# Altium schematic sheet Quad-RS232-1.0-RS232.SchDoc: Quad UART - RS232
size A4; Revision: 1.0; SheetNumber: 3; SheetTotal: 4
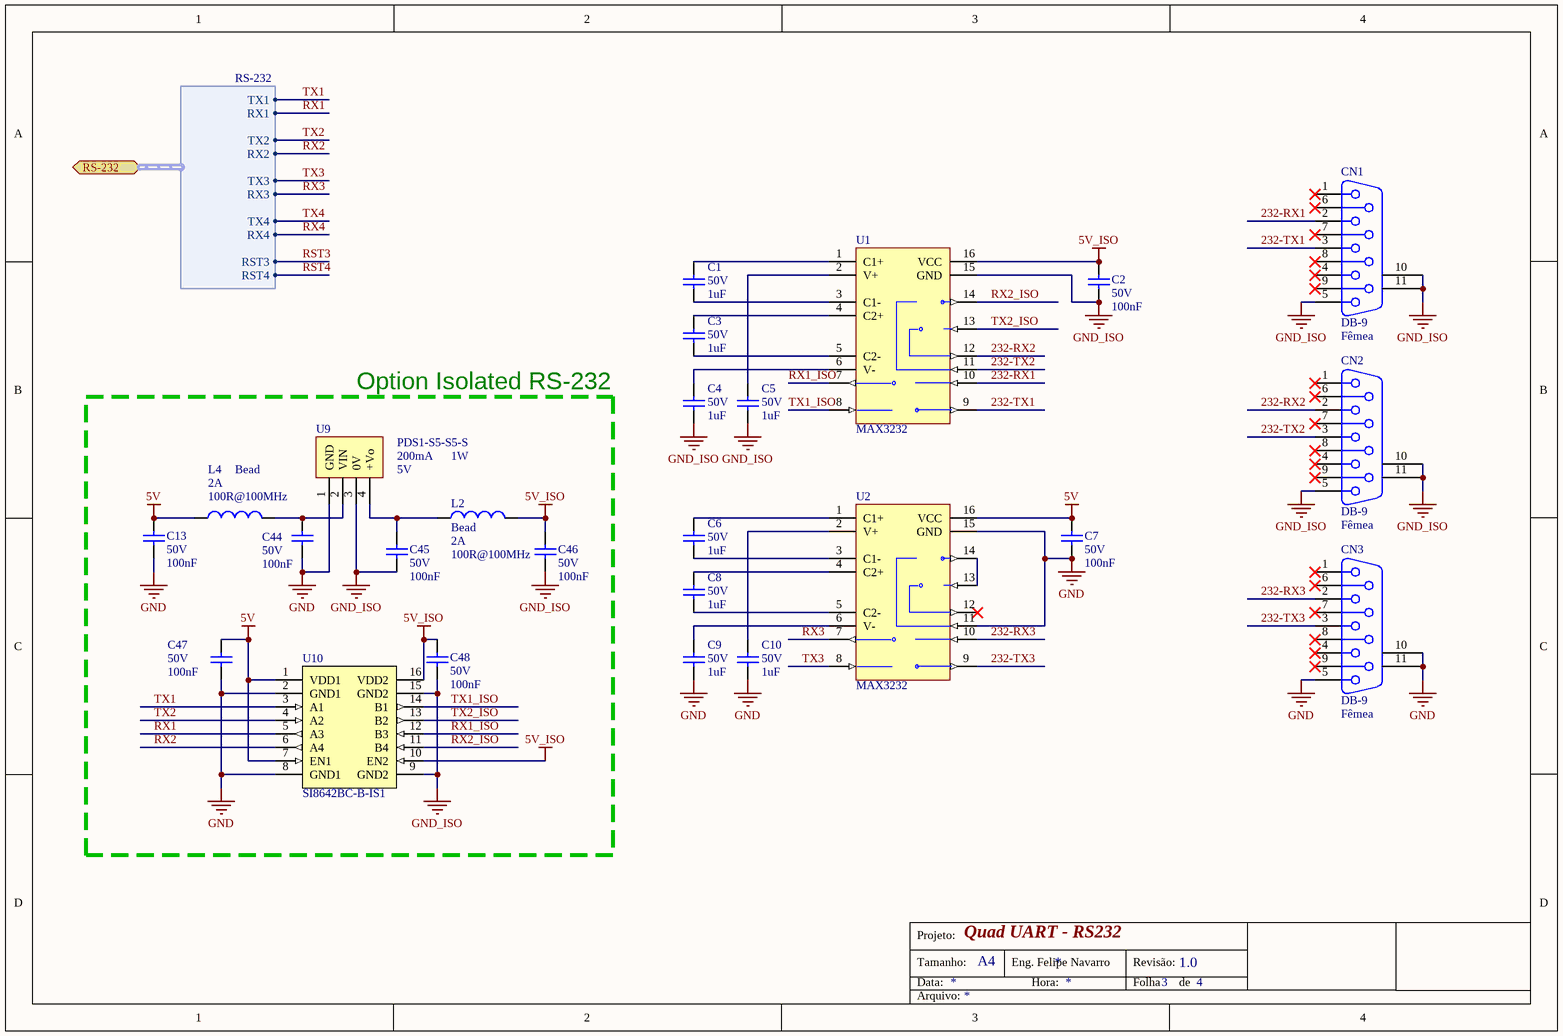
[diagram p0: Quad-RS232-1.0-RS232.SchDoc]

## Parts
C1  value 1uF  Tensão: 50V  [CC0603]  (hidden comment: Capacitor Cerâmico)
C2  value 100nF  Tensão: 50V  [CC0603]  (hidden comment: Capacitor Cerâmico)
C3  value 1uF  Tensão: 50V  [CC0603]  (hidden comment: Capacitor Cerâmico)
C4  value 1uF  Tensão: 50V  [CC0603]  (hidden comment: Capacitor Cerâmico)
C5  value 1uF  Tensão: 50V  [CC0603]  (hidden comment: Capacitor Cerâmico)
C6  value 1uF  Tensão: 50V  [CC0603]  (hidden comment: Capacitor Cerâmico)
C7  value 100nF  Tensão: 50V  [CC0603]  (hidden comment: Capacitor Cerâmico)
C8  value 1uF  Tensão: 50V  [CC0603]  (hidden comment: Capacitor Cerâmico)
C9  value 1uF  Tensão: 50V  [CC0603]  (hidden comment: Capacitor Cerâmico)
C10  value 1uF  Tensão: 50V  [CC0603]  (hidden comment: Capacitor Cerâmico)
C13  value 100nF  Tensão: 50V  [CC0603]  (hidden comment: Capacitor Cerâmico)
C44  value 100nF  Tensão: 50V  [CC0603]  (hidden comment: Capacitor Cerâmico)
C45  value 100nF  Tensão: 50V  [CC0603]  (hidden comment: Capacitor Cerâmico)
C46  value 100nF  Tensão: 50V  [CC0603]  (hidden comment: Capacitor Cerâmico)
C47  value 100nF  Tensão: 50V  [CC0603]  (hidden comment: Capacitor Cerâmico)
C48  value 100nF  Tensão: 50V  [CC0603]  (hidden comment: Capacitor Cerâmico)
CN1  DB-9  value Fêmea  [CONN DB9-F/H]
CN2  DB-9  value Fêmea  [CONN DB9-F/H]
CN3  DB-9  value Fêmea  [CONN DB9-F/H]
L2  Bead  value 100R@100MHz  Corrente: 2A  [CC0603]
L4  Bead  value 100R@100MHz  Corrente: 2A  [CC0603]
U1  MAX3232  [SOIC-16N]
U2  MAX3232  [SOIC-16N]
U9  PDS1-S5-S5-S  Corrente: 200mA  Potência: 1W  Tensão: 5V  [SIP-4N]
U10  SI8642BC-B-IS1  [SOIC-16N]

## Blocks framed on the sheet
Option Isolated RS-232: C13 C44-C48 L2 L4 U9 U10

## Ports
RS-232 (harness RS-232)

## Harnesses
RS-232: TX1, RX1, TX2, RX2, TX3, RX3, TX4, RX4, RST3, RST4

## Nets
5V: C7.2 C13.2 C47.2 L4.1 U2.16(VCC) U10.1(VDD1) U10.7(EN1)
5V_ISO: C2.2 C46.2 C48.2 L2.2 U1.16(VCC) U10.10(EN2) U10.16(VDD2)
GND: C7.1 C9.1 C10.1 C13.1 C44.1 C47.1 CN3.5 CN3.10 CN3.11 U2.11(T1IN) U2.15(GND) U9.1(GND) U10.2(GND1) U10.8(GND1)
GND_ISO: C2.1 C4.1 C5.1 C45.1 C46.1 C48.1 CN1.5 CN1.10 CN1.11 CN2.5 CN2.10 CN2.11 U1.15(GND) U9.3(0V) U10.9(GND2) U10.15(GND2)
232-RX1: CN1.2 U1.10(T2IN)
232-RX2: CN2.2 U1.12(R1OUT)
232-RX3: CN3.2 U2.10(T2IN)
232-TX1: CN1.3 U1.9(R2OUT)
232-TX2: CN2.3 U1.11(T1IN)
232-TX3: CN3.3 U2.9(R2OUT)
RST3: port RS-232.RST3
RST4: port RS-232.RST4
RX1: U10.5(A3) ; port RS-232.RX1
RX1_ISO: U1.7(T2OUT) U10.12(B3)
RX2: U10.6(A4) ; port RS-232.RX2
RX2_ISO: U1.14(T1OUT) U10.11(B4)
RX3: U2.7(T2OUT) ; port RS-232.RX3
RX4: port RS-232.RX4
TX1: U10.3(A1) ; port RS-232.TX1
TX1_ISO: U1.8(R2IN) U10.14(B1)
TX2: U10.4(A2) ; port RS-232.TX2
TX2_ISO: U1.13(R1IN) U10.13(B2)
TX3: U2.8(R2IN) ; port RS-232.TX3
TX4: port RS-232.TX4
NetC1_1: C1.1 U1.3(C1-)
NetC1_2: C1.2 U1.1(C1+)
NetC3_1: C3.1 U1.5(C2-)
NetC3_2: C3.2 U1.4(C2+)
NetC4_2: C4.2 U1.6(V-)
NetC5_2: C5.2 U1.2(V+)
NetC6_1: C6.1 U2.3(C1-)
NetC6_2: C6.2 U2.1(C1+)
NetC8_1: C8.1 U2.5(C2-)
NetC8_2: C8.2 U2.4(C2+)
NetC9_2: C9.2 U2.6(V-)
NetC10_2: C10.2 U2.2(V+)
NetC44_2: C44.2 L4.2 U9.2(VIN)
NetC45_2: C45.2 L2.1 U9.4(+Vo)
NetU2_13: U2.13(R1IN) U2.14(T1OUT)

Not connected (* = marked no-connect by the designer): CN1 1* 4* 6* 7* 8* 9*; CN2 1* 4* 6* 7* 8* 9*; CN3 1* 4* 6* 7* 8* 9*; U2 12(R1OUT)*

## Notes on the sheet
- Projeto:
- Tamanho:
- Data:
- A4
- Eng. Felipe Navarro
- Hora:
- Revisão:
- Folha
- de
- Arquivo:

## Library data of the parts
C1 C3-C6 C8-C10 = Cap 1uF 50V 0603 X5R: Capacitor (Semiconductor SIM Model); Chinês: Local; ChinesePrice: 0,01100; Corrente: *A; Potência: *W; Obs:: X5R; Tolerância: ±10%; Supplier 1: Digi-Key; Supplier Part Number 1: 587-2400-1-ND; ComponentLink1Description: Datasheet; ComponentLink1URL: D:\Tecnoclade\Datasheet\!DataMissing.pdf
C2 C7 C13 C44-C48 = Cap 100nF 50V 0603 X7R: Capacitor (Semiconductor SIM Model); Chinês: Local; ChinesePrice: 0,00250; Corrente: *A; Potência: *W; Obs:: X7R; Tolerância: ±10%; Supplier 1: Digi-Key; Supplier Part Number 1: 1276-1000-1-ND; ComponentLink1Description: Datasheet; ComponentLink1URL: D:\Tecnoclade\Datasheet\!DataMissing.pdf
CN1-CN3 = DB-9 Femea: Receptacle Assembly, 9 Position, Right Angle; ChinesePrice: 0,15700; Chinês: Proved - Local; Supplier 1: Digi-Key; Supplier Part Number 1: A35109-ND
L2 L4 = Bd 100R@100MHz 0603 2A: ChinesePrice: 0,00000; Chinês: ----; Obs:: Ferrite (0R04); Tolerância: ±25%; Potência: *; Supplier 1: Digi-Key; Supplier Part Number 1: 445-2984-1-ND; Tensão: *; ComponentLink1Description: Datasheet; ComponentLink1URL: D:\Tecnoclade\Datasheet\!DataMissing.pdf; Substituição: 00/00/0000
U1 U2 = MAX3232: 3.0V TO 5.5V, Low-Power, up to 1Mbps, True RS-232 Transceiver Using Four 0.1µF External Capacitor; ChinesePrice: 0,77000; Chinês: Maxim or TI; Supplier 1: Digi-Key; Supplier Part Number 1: 296-13098-1-ND
U9 = Fonte PDS1-S5-S5-S: Fonte chaveada isolada; ChinesePrice: 0,00000; Chinês: ----; Supplier 1: Digi-Key; Value: *; Supplier Part Number 1: 102-2758-ND; Obs:: *; Tolerância: *; ComponentLink1Description: Datasheet; ComponentLink1URL: D:\Tecnoclade\Datasheet\Fonte PDS1-S.pdf
U10 = SI8642: LOW-POWER QUAD-CHANNEL DIGITAL ISOLATOR; ChinesePrice: 0,00000; Chinês: ----; Supplier 1: Digi-Key; Supplier Part Number 1: 336-2092-5-ND; Corrente: *; Potência: *; Tensão: *; Value: *; Obs:: *; Tolerância: *; ComponentLink1Description: Datasheet; ComponentLink1URL: D:\Tecnoclade\Datasheet\SI8640.pdf